# EAGLE design IN-17 controller (EAGLE 8.6.0)
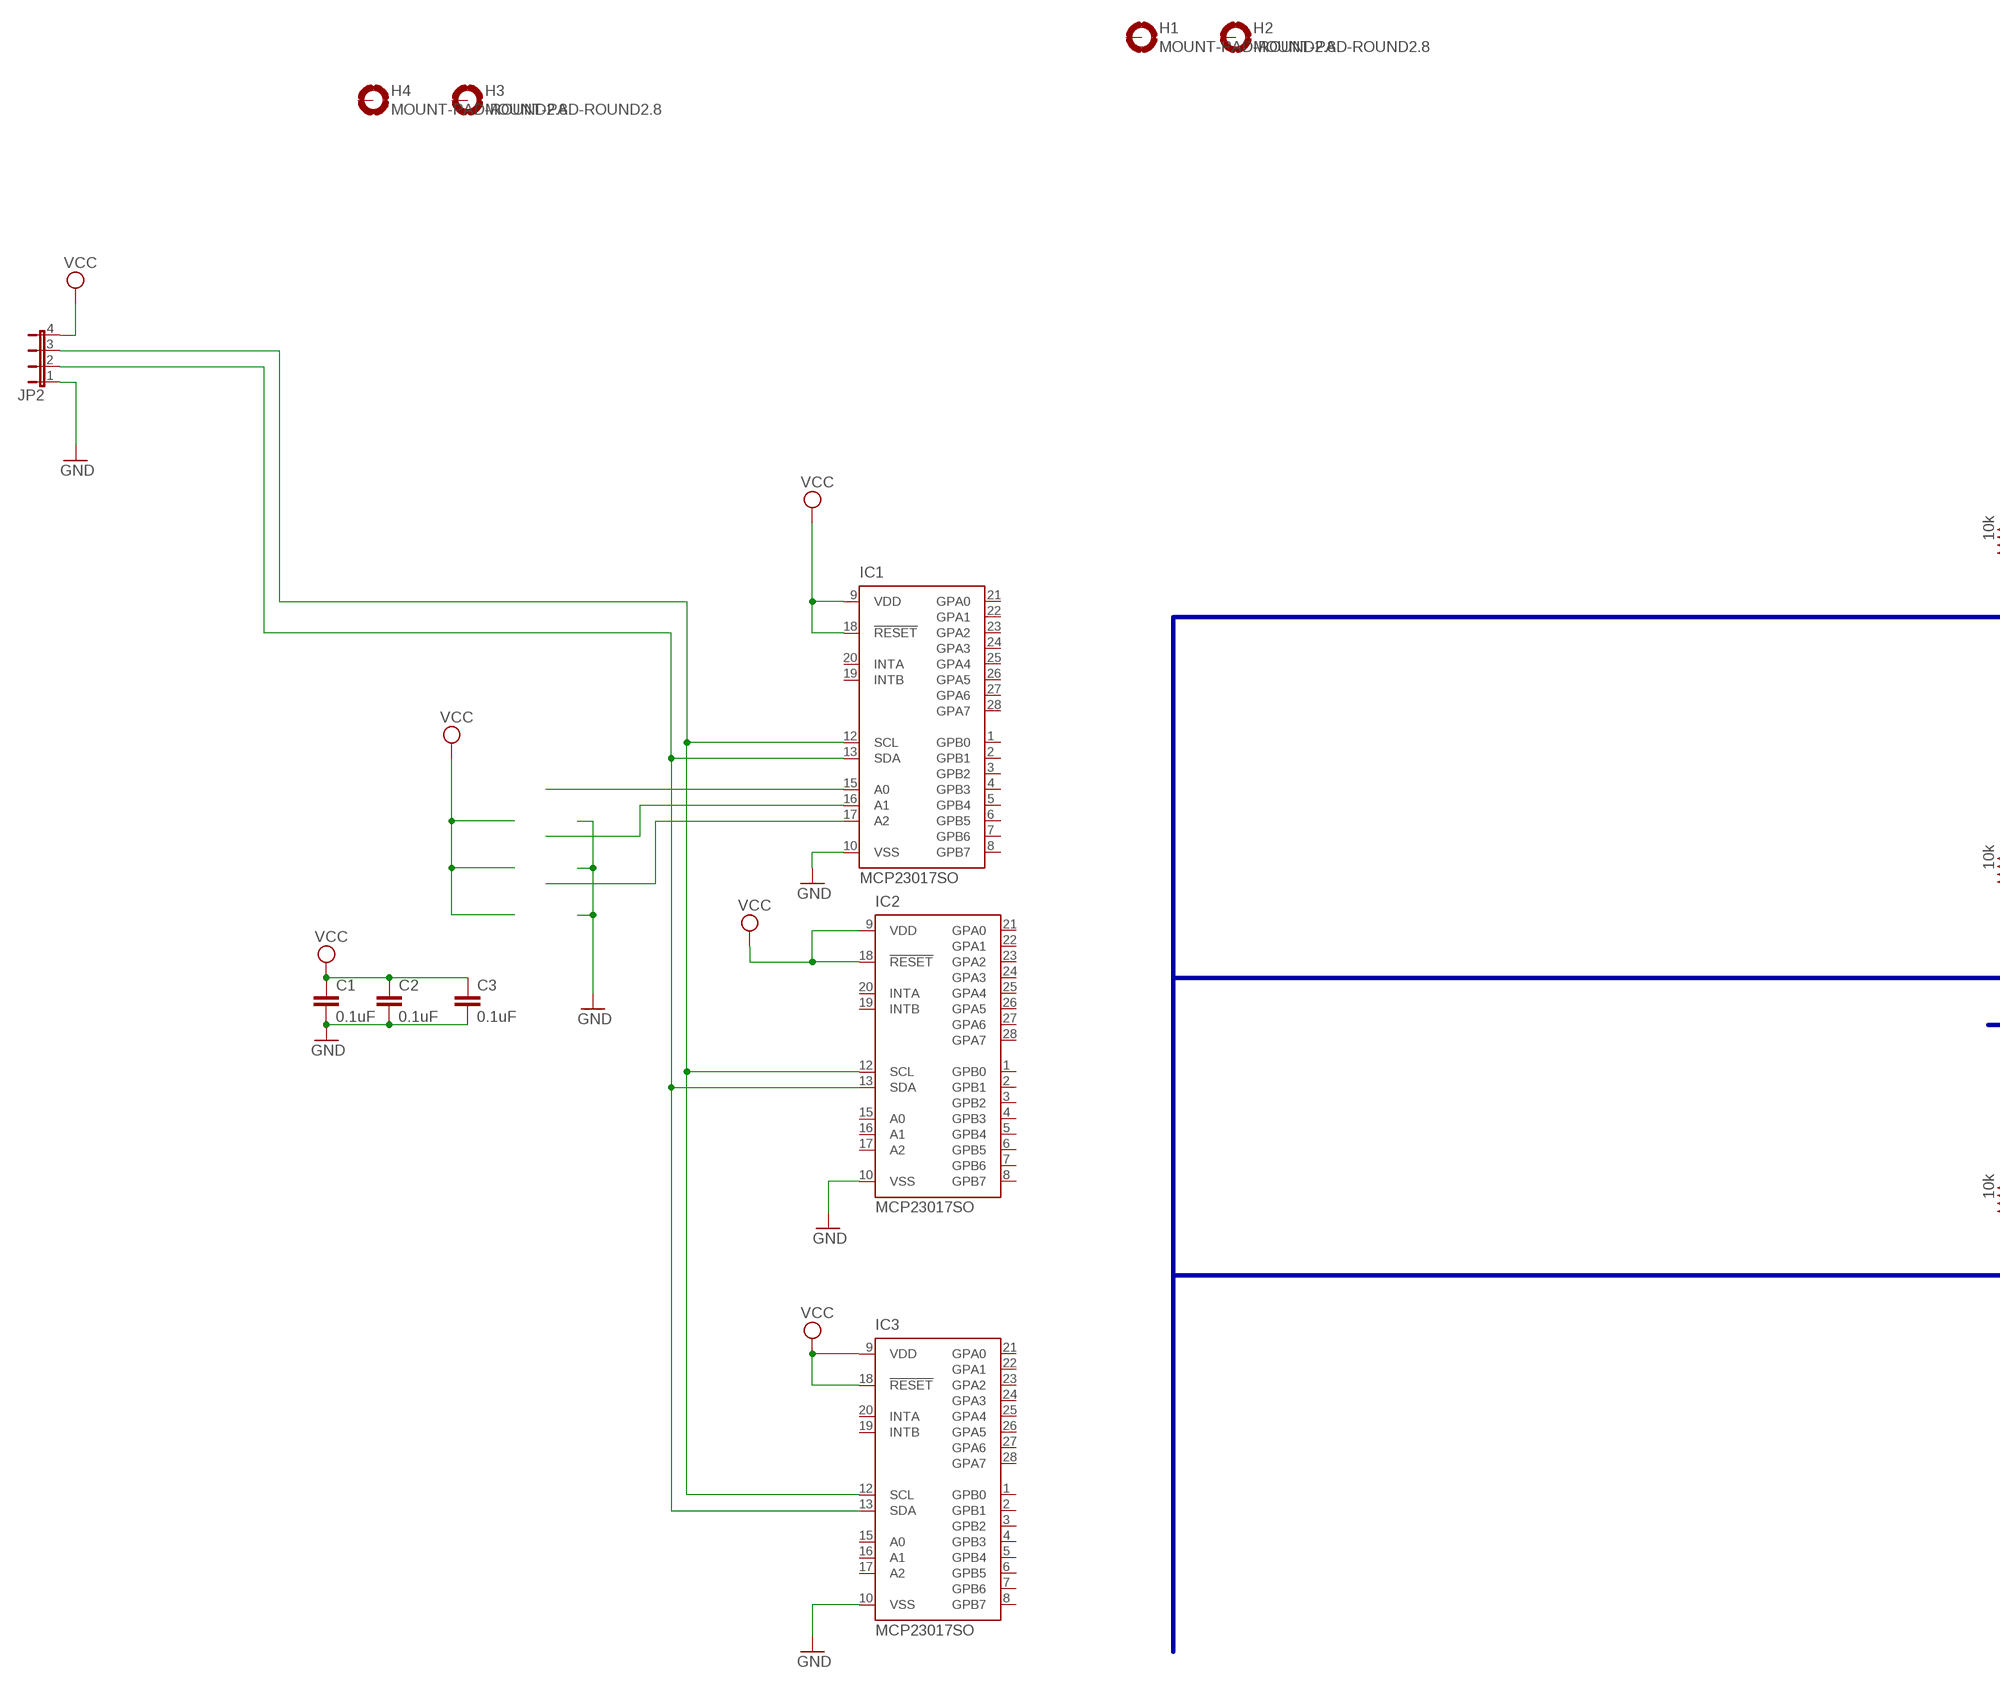
[diagram p0: schematic, sheet 1, part 1 of 2]
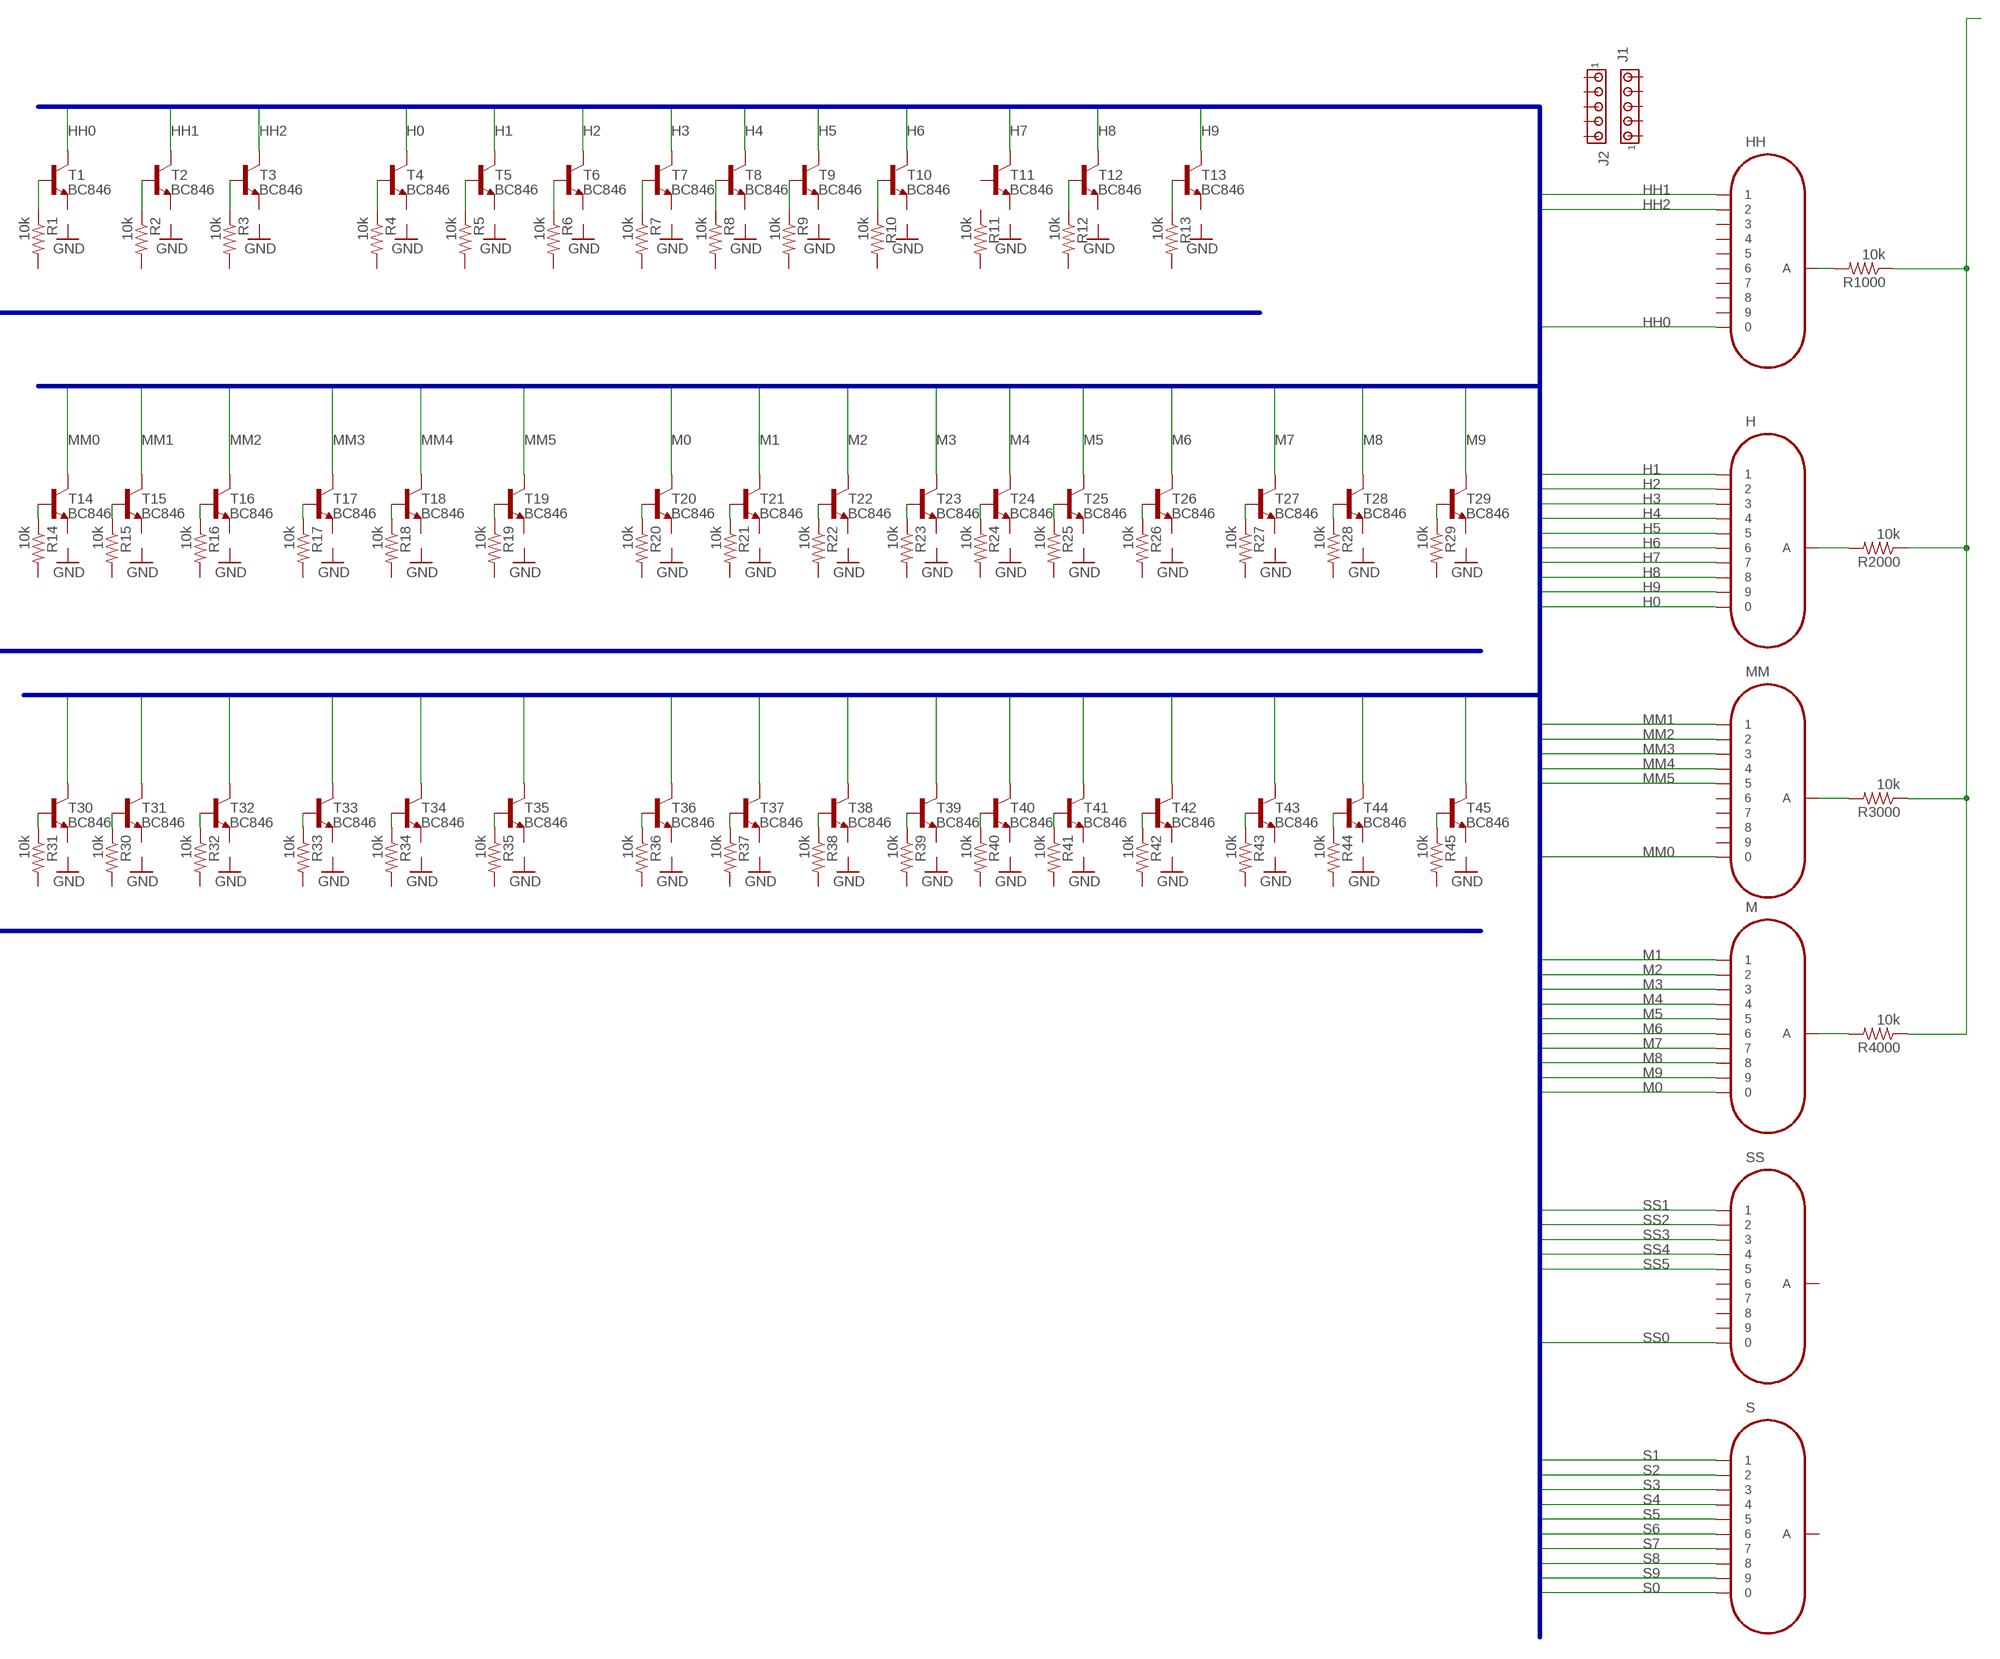
[diagram p1: schematic, sheet 1, part 2 of 2]

## Parts
C1  0.1uF  C-EUC1206  [C1206]
C2  0.1uF  C-EUC1206  [C1206]
C3  0.1uF  C-EUC1206  [C1206]
H  IN-17  [IN-17]
H1  MOUNT-PAD-ROUND2.8  [2,8-PAD]
H2  MOUNT-PAD-ROUND2.8  [2,8-PAD]
H3  MOUNT-PAD-ROUND2.8  [2,8-PAD]
H4  MOUNT-PAD-ROUND2.8  [2,8-PAD]
HH  IN-17  [IN-17]
IC1  MCP23017SO  [SO28W]
IC2  MCP23017SO  [SO28W]
IC3  MCP23017SO  [SO28W]
J1  MTA05-100  [10X05MTA]
J2  MTA05-100  [10X05MTA]
JP2  JP4E  [JP4]
M  IN-17  [IN-17]
MM  IN-17  [IN-17]
R1  10k  R-US_M0805  [M0805]
R2  10k  R-US_M0805  [M0805]
R3  10k  R-US_M0805  [M0805]
R4  10k  R-US_M0805  [M0805]
R5  10k  R-US_M0805  [M0805]
R6  10k  R-US_M0805  [M0805]
R7  10k  R-US_M0805  [M0805]
R8  10k  R-US_M0805  [M0805]
R9  10k  R-US_M0805  [M0805]
R10  10k  R-US_M0805  [M0805]
R11  10k  R-US_M0805  [M0805]
R12  10k  R-US_M0805  [M0805]
R13  10k  R-US_M0805  [M0805]
R14  10k  R-US_M0805  [M0805]
R15  10k  R-US_M0805  [M0805]
R16  10k  R-US_M0805  [M0805]
R17  10k  R-US_M0805  [M0805]
R18  10k  R-US_M0805  [M0805]
R19  10k  R-US_M0805  [M0805]
R20  10k  R-US_M0805  [M0805]
R21  10k  R-US_M0805  [M0805]
R22  10k  R-US_M0805  [M0805]
R23  10k  R-US_M0805  [M0805]
R24  10k  R-US_M0805  [M0805]
R25  10k  R-US_M0805  [M0805]
R26  10k  R-US_M0805  [M0805]
R27  10k  R-US_M0805  [M0805]
R28  10k  R-US_M0805  [M0805]
R29  10k  R-US_M0805  [M0805]
R30  10k  R-US_M0805  [M0805]
R31  10k  R-US_M0805  [M0805]
R32  10k  R-US_M0805  [M0805]
R33  10k  R-US_M0805  [M0805]
R34  10k  R-US_M0805  [M0805]
R35  10k  R-US_M0805  [M0805]
R36  10k  R-US_M0805  [M0805]
R37  10k  R-US_M0805  [M0805]
R38  10k  R-US_M0805  [M0805]
R39  10k  R-US_M0805  [M0805]
R40  10k  R-US_M0805  [M0805]
R41  10k  R-US_M0805  [M0805]
R42  10k  R-US_M0805  [M0805]
R43  10k  R-US_M0805  [M0805]
R44  10k  R-US_M0805  [M0805]
R45  10k  R-US_M0805  [M0805]
R1000  10k  R-US_M0805  [M0805]
R2000  10k  R-US_M0805  [M0805]
R3000  10k  R-US_M0805  [M0805]
R4000  10k  R-US_M0805  [M0805]
S  IN-17  [IN-17]
SS  IN-17  [IN-17]
T1  BC846  [SOT23]
T2  BC846  [SOT23]
T3  BC846  [SOT23]
T4  BC846  [SOT23]
T5  BC846  [SOT23]
T6  BC846  [SOT23]
T7  BC846  [SOT23]
T8  BC846  [SOT23]
T9  BC846  [SOT23]
T10  BC846  [SOT23]
T11  BC846  [SOT23]
T12  BC846  [SOT23]
T13  BC846  [SOT23]
T14  BC846  [SOT23]
T15  BC846  [SOT23]
T16  BC846  [SOT23]
T17  BC846  [SOT23]
T18  BC846  [SOT23]
T19  BC846  [SOT23]
T20  BC846  [SOT23]
T21  BC846  [SOT23]
T22  BC846  [SOT23]
T23  BC846  [SOT23]
T24  BC846  [SOT23]
T25  BC846  [SOT23]
T26  BC846  [SOT23]
T27  BC846  [SOT23]
T28  BC846  [SOT23]
T29  BC846  [SOT23]
T30  BC846  [SOT23]
T31  BC846  [SOT23]
T32  BC846  [SOT23]
T33  BC846  [SOT23]
T34  BC846  [SOT23]
T35  BC846  [SOT23]
T36  BC846  [SOT23]
T37  BC846  [SOT23]
T38  BC846  [SOT23]
T39  BC846  [SOT23]
T40  BC846  [SOT23]
T41  BC846  [SOT23]
T42  BC846  [SOT23]
T43  BC846  [SOT23]
T44  BC846  [SOT23]
T45  BC846  [SOT23]

## Nets
GND: C1.2 C2.2 C3.2 IC1.10(VSS) IC2.10(VSS) IC3.10(VSS) JP2.1
H0: H.0 T4.3(C)
H1: H.1 T5.3(C)
H2: H.2 T6.3(C)
H3: H.3 T7.3(C)
H4: H.4 T8.3(C)
H5: H.5 T9.3(C)
H6: H.6 T10.3(C)
H7: H.7 T11.3(C)
H8: H.8 T12.3(C)
H9: H.9 T13.3(C)
HH0: HH.0 T1.3(C)
HH1: HH.1 T2.3(C)
HH2: HH.2 T3.3(C)
M0: M.0 T20.3(C)
M1: M.1 T21.3(C)
M2: M.2 T22.3(C)
M3: M.3 T23.3(C)
M4: M.4 T24.3(C)
M5: M.5 T25.3(C)
M6: M.6 T26.3(C)
M7: M.7 T27.3(C)
M8: M.8 T28.3(C)
M9: M.9 T29.3(C)
MM0: MM.0 T14.3(C)
MM1: MM.1 T15.3(C)
MM2: MM.2 T16.3(C)
MM3: MM.3 T17.3(C)
MM4: MM.4 T18.3(C)
MM5: MM.5 T19.3(C)
N$1: IC1.15(A0)
N$2: R4.1 T4.1(B)
N$3: R14.1 T14.1(B)
N$4: R5.1 T5.1(B)
N$5: R6.1 T6.1(B)
N$6: R1.1 T1.1(B)
N$7: R2.1 T2.1(B)
N$8: R3.1 T3.1(B)
N$9: M.A R4000.2
N$10: R7.1 T7.1(B)
N$11: R8.1 T8.1(B)
N$12: R9.1 T9.1(B)
N$13: R10.1 T10.1(B)
N$14: H.A R2000.2
N$15: R12.1 T12.1(B)
N$16: R13.1 T13.1(B)
N$17: MM.A R3000.2
N$18: R15.1 T15.1(B)
N$19: R16.1 T16.1(B)
N$20: R17.1 T17.1(B)
N$21: R18.1 T18.1(B)
N$22: R19.1 T19.1(B)
N$23: R20.1 T20.1(B)
N$24: R21.1 T21.1(B)
N$25: R22.1 T22.1(B)
N$26: R23.1 T23.1(B)
N$28: R24.1 T24.1(B)
N$29: R25.1 T25.1(B)
N$30: R26.1 T26.1(B)
N$31: R27.1 T27.1(B)
N$32: R28.1 T28.1(B)
N$33: R29.1 T29.1(B)
N$35: R31.1 T30.1(B)
N$36: R30.1 T31.1(B)
N$37: R32.1 T32.1(B)
N$38: R1000.1 R2000.1 R3000.1 R4000.1
N$39: R33.1 T33.1(B)
N$40: IC1.16(A1)
N$41: R34.1 T34.1(B)
N$42: R35.1 T35.1(B)
N$43: IC1.17(A2)
N$44: R36.1 T36.1(B)
N$45: R37.1 T37.1(B)
N$46: R38.1 T38.1(B)
N$47: R39.1 T39.1(B)
N$48: R40.1 T40.1(B)
N$49: JP2.4 ; supply symbol labelled VCC
N$50: HH.A R1000.2
N$51: R41.1 T41.1(B)
N$52: R42.1 T42.1(B)
N$53: R44.1 T44.1(B)
N$54: R45.1 T45.1(B)
N$55: R43.1 T43.1(B)
N$88: IC1.13(SDA) IC2.13(SDA) IC3.13(SDA) JP2.2
N$89: IC1.12(SCL) IC2.12(SCL) IC3.12(SCL) JP2.3
S0: S.0 T36.3(C)
S1: S.1 T37.3(C)
S2: S.2 T38.3(C)
S3: S.3 T39.3(C)
S4: S.4 T40.3(C)
S5: S.5 T41.3(C)
S6: S.6 T42.3(C)
S7: S.7 T43.3(C)
S8: S.8 T44.3(C)
S9: S.9 T45.3(C)
SS0: SS.0 T30.3(C)
SS1: SS.1 T31.3(C)
SS2: SS.2 T32.3(C)
SS3: SS.3 T33.3(C)
SS4: SS.4 T34.3(C)
SS5: SS.5 T35.3(C)
VCC: C1.1 C2.1 C3.1 IC1.9(VDD) IC1.18(!RESET) IC2.9(VDD) IC2.18(!RESET) IC3.9(VDD) IC3.18(!RESET)
Unconnected: H1.B2,8(MOUNT) H2.B2,8(MOUNT) H3.B2,8(MOUNT) H4.B2,8(MOUNT) HH.3 HH.4 HH.5 HH.6 HH.7 HH.8 HH.9 IC1.1(GPB0) IC1.2(GPB1) IC1.3(GPB2) IC1.4(GPB3) IC1.5(GPB4) IC1.6(GPB5) IC1.7(GPB6) IC1.8(GPB7) IC1.19(INTB) IC1.20(INTA) IC1.21(GPA0) IC1.22(GPA1) IC1.23(GPA2) IC1.24(GPA3) IC1.25(GPA4) IC1.26(GPA5) IC1.27(GPA6) IC1.28(GPA7) IC2.1(GPB0) IC2.2(GPB1) IC2.3(GPB2) IC2.4(GPB3) IC2.5(GPB4) IC2.6(GPB5) IC2.7(GPB6) IC2.8(GPB7) IC2.15(A0) IC2.16(A1) IC2.17(A2) IC2.19(INTB) IC2.20(INTA) IC2.21(GPA0) IC2.22(GPA1) IC2.23(GPA2) IC2.24(GPA3) IC2.25(GPA4) IC2.26(GPA5) IC2.27(GPA6) IC2.28(GPA7) IC3.1(GPB0) IC3.2(GPB1) IC3.3(GPB2) IC3.4(GPB3) IC3.5(GPB4) IC3.6(GPB5) IC3.7(GPB6) IC3.8(GPB7) IC3.15(A0) IC3.16(A1) IC3.17(A2) IC3.19(INTB) IC3.20(INTA) IC3.21(GPA0) IC3.22(GPA1) IC3.23(GPA2) IC3.24(GPA3) IC3.25(GPA4) IC3.26(GPA5) IC3.27(GPA6) IC3.28(GPA7) J1.1 J1.2 J1.3 J1.4 J1.5 J2.1 J2.2 J2.3 J2.4 J2.5 MM.6 MM.7 MM.8 MM.9 R1.2 R2.2 R3.2 R4.2 R5.2 R6.2 R7.2 R8.2 R9.2 R10.2 R11.1 R11.2 R12.2 R13.2 R14.2 R15.2 R16.2 R17.2 R18.2 R19.2 R20.2 R21.2 R22.2 R23.2 R24.2 R25.2 R26.2 R27.2 R28.2 R29.2 R30.2 R31.2 R32.2 R33.2 R34.2 R35.2 R36.2 R37.2 R38.2 R39.2 R40.2 R41.2 R42.2 R43.2 R44.2 R45.2 S.A SS.6 SS.7 SS.8 SS.9 SS.A T1.2(E) T2.2(E) T3.2(E) T4.2(E) T5.2(E) T6.2(E) T7.2(E) T8.2(E) T9.2(E) T10.2(E) T11.1(B) T11.2(E) T12.2(E) T13.2(E) T14.2(E) T15.2(E) T16.2(E) T17.2(E) T18.2(E) T19.2(E) T20.2(E) T21.2(E) T22.2(E) T23.2(E) T24.2(E) T25.2(E) T26.2(E) T27.2(E) T28.2(E) T29.2(E) T30.2(E) T31.2(E) T32.2(E) T33.2(E) T34.2(E) T35.2(E) T36.2(E) T37.2(E) T38.2(E) T39.2(E) T40.2(E) T41.2(E) T42.2(E) T43.2(E) T44.2(E) T45.2(E)

## Buses
HH[0..2],H[0..9],MM[0..5],M[0..9],SS[0..5],S[0..9]
THH[0..3],TH[0..9],TMM[0..5],TM[0..9],TSS[0..5],TS[0..9]

## Library data of the parts
C1-C3 = rcl:C-EU: CAPACITOR, European symbol
H HH M MM S SS = russian-nixies:IN-17: IN-17: tiny numeric topview nixie tube
H1-H4 = holes:MOUNT-PAD-ROUND: MOUNTING PAD, round
IC1-IC3 = adafruit:MCP23017: http://ww1.microchip.com/downloads/en/DeviceDoc/21952a.pdf Source: http://ww1.microchip.com/downloads/en/DeviceDoc/21952a.pdf
J1 J2 = con-amp:MTA05-100: AMP connector
JP2 = jumper:JP4E: JUMPER
R1-R45 R1000 R2000 R3000 R4000 = adafruit:R-US_: RESISTOR, American symbol
T1-T45 = transistor:BC846: NPN TRANSISTOR

## Board
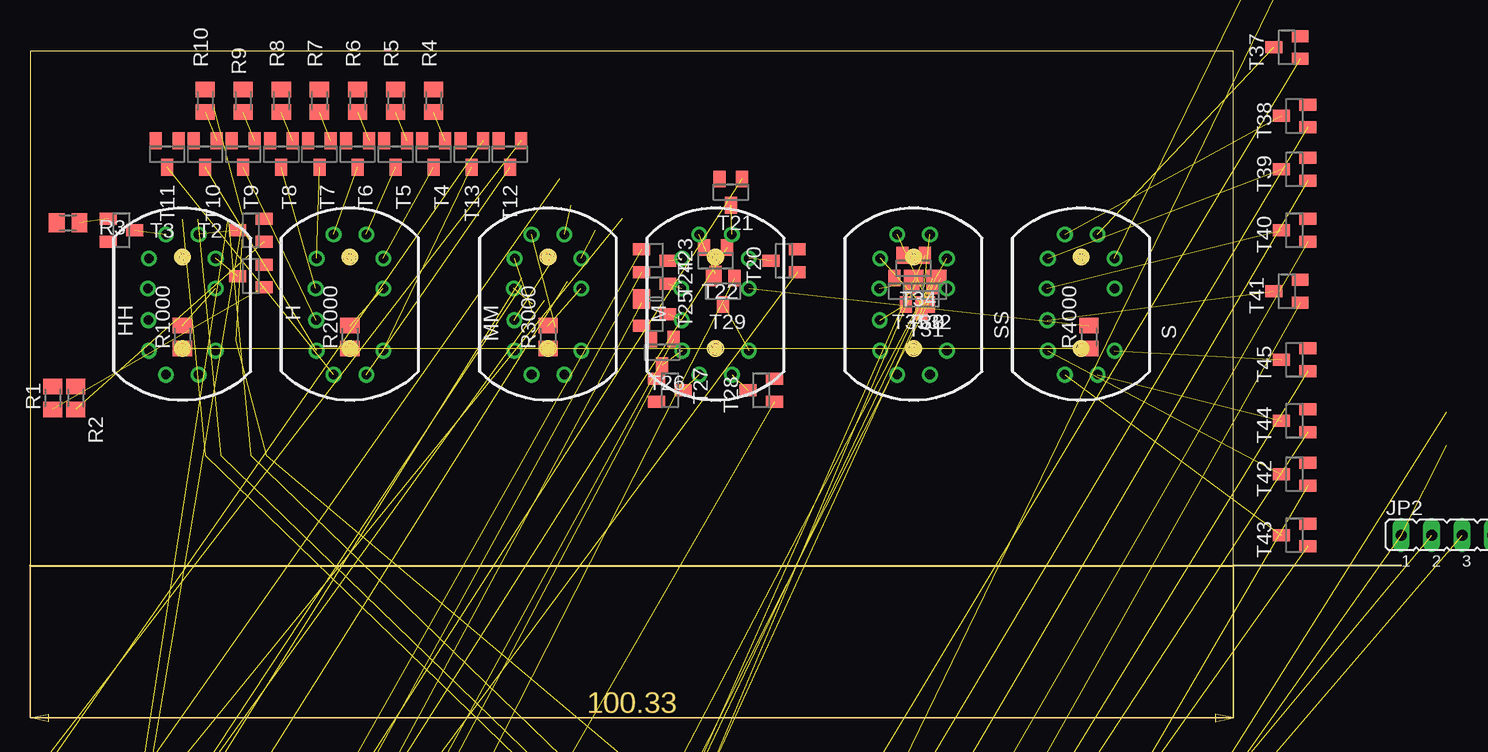
[diagram p2: board, top side]
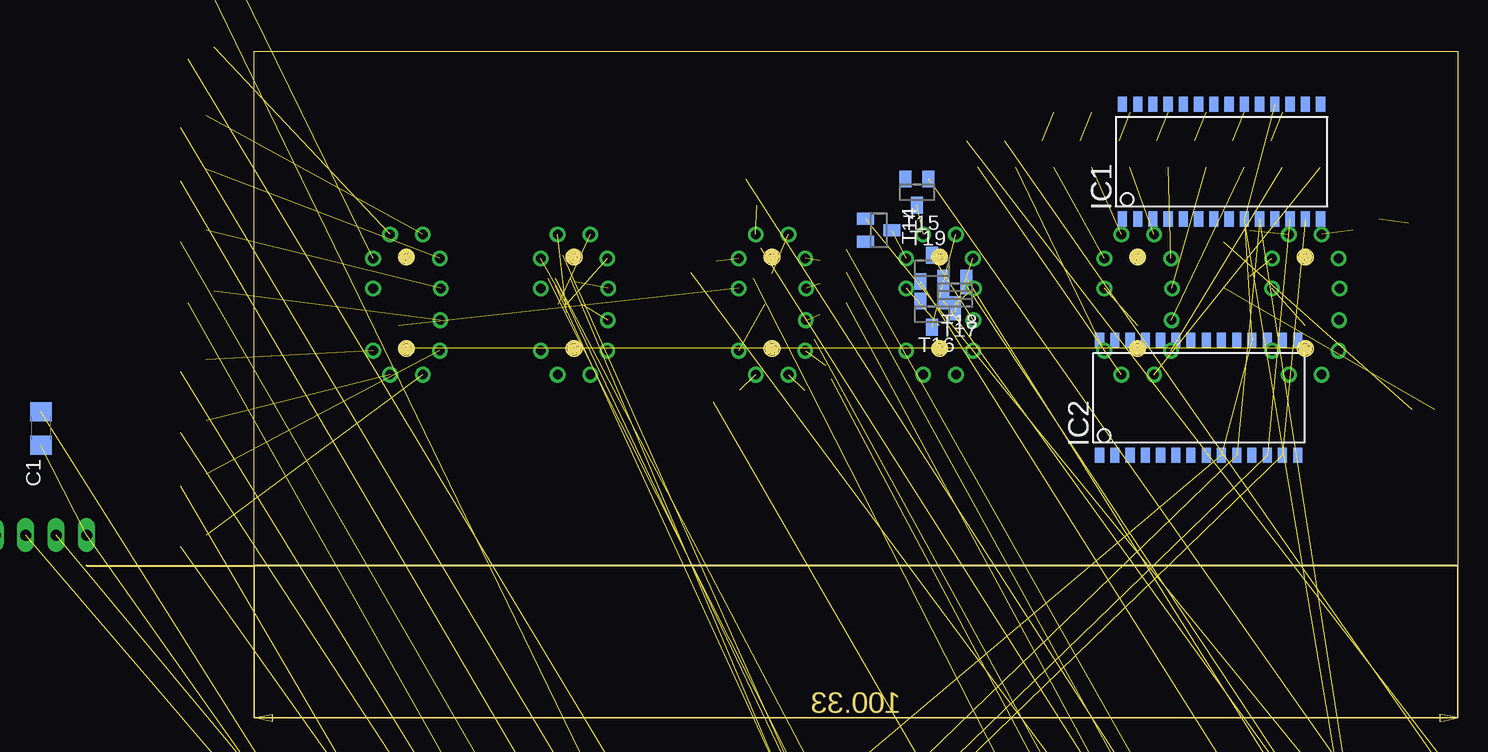
[diagram p3: board, bottom side, seen from below]

Size 114.3 x 42.85 mm. Coordinates in mm from the lower left corner, seen from the top.
Outline: 100.31,0 100.31,42.85 0,42.85 0,0 100.31,0
Outline: 114.3,0 100.31,0
Copper layers (1*16): Top 0.035mm / dielectric 1.5mm / Bottom 0.035mm
Design rules "default": minimum track width 10mil, minimum drill 24mil, track to track 8mil, track to pad 8mil, pad to pad 8mil, via to via 8mil, smd to smd 8mil, copper to edge 40mil, drill to drill 8mil, minimum pad ring 10mil, minimum via ring 8mil, stop-mask expansion 4mil, vias tented up to drill 0mil, thermal gap 10mil

### Footprints (pad centres in the part's own frame; a part is rotated, then mirrored left to right if it is on the bottom)
C1206 = smd 1.6 x 1.8: 1 -1.4,0; 2 1.4,0
IN-17 = drill 0.8: 0 2.777,4; 1 1.365,6; 2 -1.365,6; 3 -2.778,4; 4 -2.858,1.5; 5 -2.818,-1.143; 6 -2.778,-3.683; 7 -1.365,-5.683; 8 1.365,-5.683; 9 2.777,-3.683; A 2.777,1.5
2,8-PAD = drill 2.8 pad 5.334: B2,8 0,0
SO28W = smd 0.762 x 1.27: 1 -7.62,-4.78; 2 -6.35,-4.78; 3 -5.08,-4.78; 4 -3.81,-4.78; 5 -2.54,-4.78; 6 -1.27,-4.78; 7 0,-4.78; 8 1.27,-4.78; 9 2.54,-4.78; 10 3.81,-4.78; 11 5.08,-4.78; 12 6.35,-4.78; 13 7.62,-4.78; 14 8.89,-4.78; 15 8.89,4.78; 16 7.62,4.78; 17 6.35,4.78; 18 5.08,4.78; 19 3.81,4.78; 20 2.54,4.78; 21 1.27,4.78; 22 0,4.78; 23 -1.27,4.78; 24 -2.54,4.78; 25 -3.81,4.78; 26 -5.08,4.78; 27 -6.35,4.78; 28 -7.62,4.78
10X05MTA = drill 1.016 long: 1 5.08,0; 2 2.54,0; 3 0,0; 4 -2.54,0; 5 -5.08,0
JP4 = drill 0.914 long: 1 -3.81,0; 2 -1.27,0; 3 1.27,0; 4 3.81,0
M0805 = smd 1.3 x 1.6: 1 -0.95,0; 2 0.95,0
SOT23 = smd 1 x 1.4: 1 -0.95,-1.1; 2 0.95,-1.1; 3 0,1.1

### Placement (x,y rotation side)
C1  118.11,11.43 270 bottom  (outside the outline)
C2  -34.29,-288.29 0 top  (outside the outline)
C3  -34.29,-294.64 0 top  (outside the outline)
H  26.67,21.59 0 top
H1  139.06,24.77 0 top  (outside the outline)
H2  130.18,70.48 0 top  (outside the outline)
H3  130.81,53.34 0 top  (outside the outline)
H4  130.18,38.1 0 top  (outside the outline)
HH  12.7,21.59 0 top
IC1  20.32,33.66 0 bottom
IC2  22.23,13.97 0 bottom
IC3  81.92,-43.81 0 bottom  (outside the outline)
J1  -23.5,-305.44 0 top  (outside the outline)
J2  -23.5,-320.68 0 top  (outside the outline)
JP2  118.11,2.54 0 top
M  57.15,21.59 0 top
MM  43.18,21.59 0 top
R1  1.91,13.97 90 top
R2  3.81,13.97 90 top
R3  3.17,28.57 180 top
R4  33.66,38.73 90 top
R5  30.48,38.73 90 top
R6  27.3,38.73 90 top
R7  24.13,38.73 90 top
R8  20.95,38.73 90 top
R9  17.78,38.73 90 top
R10  14.61,38.73 90 top
R11  -10.79,-18.41 0 top  (outside the outline)
R12  -34.29,-63.5 0 top  (outside the outline)
R13  -34.29,-69.22 0 top  (outside the outline)
R14  -34.29,-74.93 0 top  (outside the outline)
R15  -34.29,-80.64 0 top  (outside the outline)
R16  -34.29,-86.36 0 top  (outside the outline)
R17  -34.29,-92.08 0 top  (outside the outline)
R18  -34.29,-97.79 0 top  (outside the outline)
R19  -34.29,-103.5 0 top  (outside the outline)
R20  -34.29,-109.22 0 top  (outside the outline)
R21  -34.29,-114.94 0 top  (outside the outline)
R22  -34.29,-120.65 0 top  (outside the outline)
R23  -34.29,-126.36 0 top  (outside the outline)
R24  -34.29,-132.08 0 top  (outside the outline)
R25  -34.29,-137.79 0 top  (outside the outline)
R26  -34.29,-143.51 0 top  (outside the outline)
R27  -34.29,-149.22 0 top  (outside the outline)
R28  -34.29,-154.94 0 top  (outside the outline)
R29  -34.29,-160.66 0 top  (outside the outline)
R30  -10.79,-166.37 0 top  (outside the outline)
R31  -34.29,-186.69 0 top  (outside the outline)
R32  -29.21,-186.69 0 top  (outside the outline)
R33  -24.13,-186.69 0 top  (outside the outline)
R34  -19.05,-186.69 0 top  (outside the outline)
R35  -13.97,-186.69 0 top  (outside the outline)
R36  -8.89,-186.69 0 top  (outside the outline)
R37  -34.29,-192.41 0 top  (outside the outline)
R38  -29.21,-192.41 0 top  (outside the outline)
R39  -24.13,-192.41 0 top  (outside the outline)
R40  -19.05,-192.41 0 top  (outside the outline)
R41  -13.97,-192.41 0 top  (outside the outline)
R42  -8.89,-192.41 0 top  (outside the outline)
R43  -34.29,-198.12 0 top  (outside the outline)
R44  -29.21,-198.12 0 top  (outside the outline)
R45  -24.13,-198.12 0 top  (outside the outline)
R1000  12.7,19.05 90 top
R2000  26.67,19.05 90 top
R3000  43.18,19.05 90 top
R4000  88.27,19.05 90 top
S  87.63,21.59 0 top
SS  73.66,21.59 0 top
T1  18.41,24.13 90 top
T2  18.41,27.94 90 top
T3  7.62,27.94 270 top
T4  33.66,34.29 180 top
T5  30.48,34.29 180 top
T6  27.3,34.29 180 top
T7  24.13,34.29 180 top
T8  20.95,34.29 180 top
T9  17.78,34.29 180 top
T10  14.61,34.29 180 top
T11  11.43,34.29 180 top
T12  40.01,34.29 180 top
T13  36.83,34.29 180 top
T14  48.26,27.94 270 bottom
T15  45.09,31.11 180 bottom
T16  43.81,20.95 180 bottom
T17  41.91,22.23 180 bottom
T18  41.91,22.86 180 bottom
T19  43.81,24.77 0 bottom
T20  62.87,25.4 90 top
T21  58.42,31.11 180 top
T22  57.15,25.4 180 top
T23  52.07,25.4 270 top
T24  52.07,23.5 270 top
T25  52.07,20.95 270 top
T26  52.7,17.78 180 top
T27  53.34,14.61 270 top
T28  60.96,14.61 90 top
T29  57.78,22.86 180 top
T30  74.3,22.86 180 top
T31  74.3,22.23 180 top
T32  74.93,22.86 180 top
T33  74.3,22.86 180 top
T34  73.66,24.77 180 top
T35  73.03,22.86 180 top
T36  103.5,50.16 90 top  (outside the outline)
T37  104.78,43.18 90 top
T38  105.41,37.47 90 top
T39  105.41,33.02 90 top
T40  105.41,27.94 90 top
T41  104.78,22.86 90 top
T42  105.41,7.62 90 top
T43  105.41,2.54 90 top
T44  105.41,12.06 90 top
T45  105.41,17.14 90 top

### Tracks (layer width: path | path; a pad name or v marks a point on that pad's centre or on a via)
GND  (6 unrouted)
H0  (1 unrouted)
H1  (1 unrouted)
H2  (1 unrouted)
H3  (1 unrouted)
H4  (1 unrouted)
H5  (1 unrouted)
H6  (1 unrouted)
H7  (1 unrouted)
H8  (1 unrouted)
H9  (1 unrouted)
HH0  (1 unrouted)
  Top 0.203: HH.0 15.88,25.99
HH1  (1 unrouted)
HH2  (1 unrouted)
  Top 0.203: HH.2 10.98,27.94
M0  (1 unrouted)
M1  (1 unrouted)
M2  (1 unrouted)
M3  (1 unrouted)
M4  (1 unrouted)
M5  (1 unrouted)
M6  (1 unrouted)
M7  (1 unrouted)
M8  (1 unrouted)
M9  (1 unrouted)
MM0  (1 unrouted)
MM1  (1 unrouted)
MM2  (1 unrouted)
MM3  (1 unrouted)
MM4  (1 unrouted)
MM5  (1 unrouted)
N$2  (1 unrouted)
N$3  (1 unrouted)
N$4  (1 unrouted)
N$5  (1 unrouted)
N$6  (1 unrouted)
N$7  (1 unrouted)
N$8  (1 unrouted)
N$9  (1 unrouted)
N$10  (1 unrouted)
N$11  (1 unrouted)
N$12  (1 unrouted)
N$13  (1 unrouted)
N$14  (1 unrouted)
N$15  (1 unrouted)
N$16  (1 unrouted)
N$17  (1 unrouted)
N$18  (1 unrouted)
N$19  (1 unrouted)
N$20  (1 unrouted)
N$21  (1 unrouted)
N$22  (1 unrouted)
N$23  (1 unrouted)
N$24  (1 unrouted)
N$25  (1 unrouted)
N$26  (1 unrouted)
N$28  (1 unrouted)
N$29  (1 unrouted)
N$30  (1 unrouted)
N$31  (1 unrouted)
N$32  (1 unrouted)
N$33  (1 unrouted)
N$35  (1 unrouted)
N$36  (1 unrouted)
N$37  (1 unrouted)
N$38  (3 unrouted)
N$39  (1 unrouted)
N$41  (1 unrouted)
N$42  (1 unrouted)
N$44  (1 unrouted)
N$45  (1 unrouted)
N$46  (1 unrouted)
N$47  (1 unrouted)
N$48  (1 unrouted)
N$50  (1 unrouted)
N$51  (1 unrouted)
N$52  (1 unrouted)
N$53  (1 unrouted)
N$54  (1 unrouted)
N$55  (1 unrouted)
N$88  (3 unrouted)
N$89  (3 unrouted)
S0  (1 unrouted)
S1  (1 unrouted)
S2  (1 unrouted)
S3  (1 unrouted)
S4  (1 unrouted)
S5  (1 unrouted)
S6  (1 unrouted)
S7  (1 unrouted)
S8  (1 unrouted)
S9  (1 unrouted)
SS0  (1 unrouted)
SS1  (1 unrouted)
SS2  (1 unrouted)
SS3  (1 unrouted)
SS4  (1 unrouted)
SS5  (1 unrouted)
VCC  (8 unrouted)

### Text on the board
Bottom: SteamClock | SteamClock